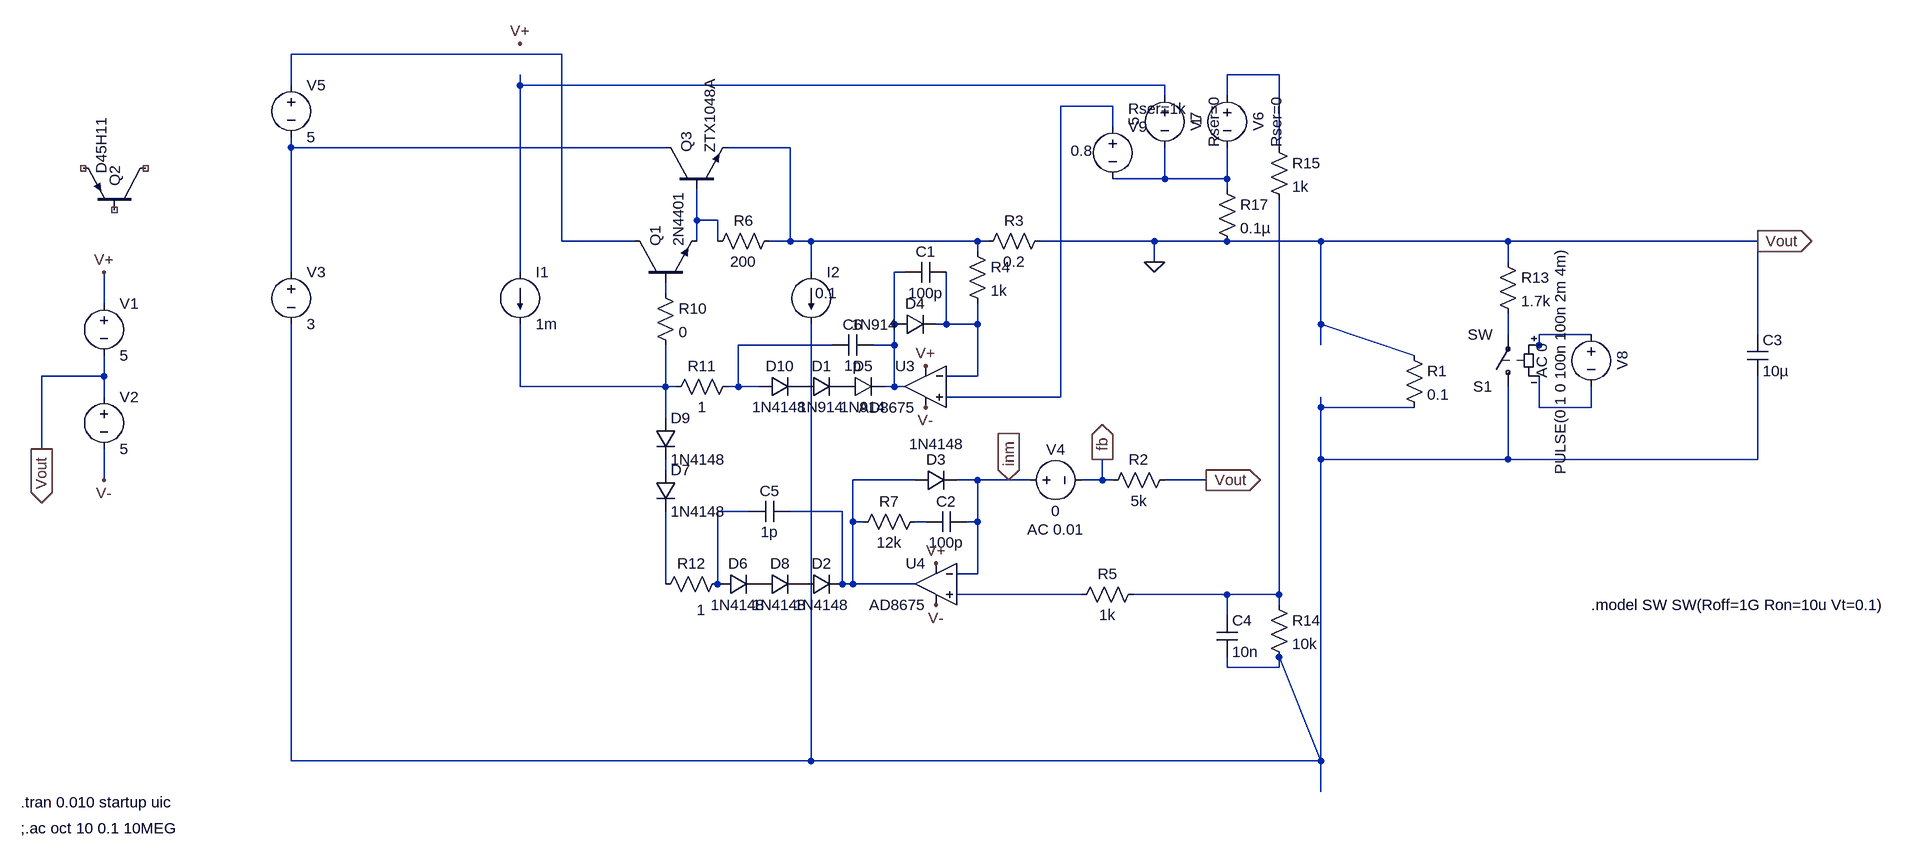
[diagram p0: schematic blackdog_experiments_head.asc]
blackdog_experiments_head.asc, the LTspice schematic file:
Version 4
SHEET 1 2384 1220
WIRE 96 -416 -320 -416
WIRE 1200 -384 1120 -384
WIRE -320 -368 -320 -416
WIRE 32 -368 32 -384
WIRE 1024 -368 32 -368
WIRE 1024 -352 1024 -368
WIRE 1120 -352 1120 -384
WIRE 944 -336 864 -336
WIRE 944 -304 944 -336
WIRE -320 -272 -320 -288
WIRE 256 -272 -320 -272
WIRE 448 -272 352 -272
WIRE 1200 -272 1200 -384
WIRE 1024 -224 1024 -272
WIRE 1024 -224 944 -224
WIRE 1120 -224 1120 -272
WIRE 1120 -224 1024 -224
WIRE 1120 -208 1120 -224
WIRE 304 -160 304 -208
WIRE 336 -160 304 -160
WIRE 96 -128 96 -416
WIRE 208 -128 96 -128
WIRE 304 -128 304 -160
WIRE 336 -128 336 -160
WIRE 448 -128 448 -272
WIRE 448 -128 416 -128
WIRE 480 -128 448 -128
WIRE 736 -128 480 -128
WIRE 752 -128 736 -128
WIRE 1008 -128 832 -128
WIRE 1120 -128 1008 -128
WIRE 1264 -128 1120 -128
WIRE 1552 -128 1264 -128
WIRE 1936 -128 1552 -128
WIRE 736 -112 736 -128
WIRE 1008 -96 1008 -128
WIRE 1552 -96 1552 -128
WIRE -320 -80 -320 -272
WIRE 32 -80 32 -368
WIRE 480 -80 480 -128
WIRE 624 -80 608 -80
WIRE 256 -48 256 -64
WIRE -608 -32 -608 -80
WIRE 608 0 608 -80
WIRE 688 0 688 -80
WIRE 688 0 672 0
WIRE 736 0 736 -32
WIRE 736 0 688 0
WIRE 1264 0 1264 -128
WIRE 1552 16 1552 -16
WIRE 1680 16 1600 16
WIRE 1936 16 1936 -128
WIRE 512 32 368 32
WIRE 608 32 608 0
WIRE 608 32 576 32
WIRE 1264 32 1264 0
WIRE 1600 32 1600 16
WIRE 1600 32 1584 32
WIRE 1408 48 1264 0
WIRE -608 80 -608 48
WIRE -608 80 -704 80
WIRE 736 80 736 0
WIRE 736 80 688 80
WIRE 32 96 32 0
WIRE 256 96 256 32
WIRE 256 96 32 96
WIRE 272 96 256 96
WIRE 368 96 368 32
WIRE 368 96 352 96
WIRE 400 96 368 96
WIRE 608 96 608 32
WIRE 608 96 592 96
WIRE 624 96 608 96
WIRE -608 112 -608 80
WIRE 864 112 864 -336
WIRE 864 112 688 112
WIRE 1264 128 1264 112
WIRE 1408 128 1264 128
WIRE 1600 128 1600 80
WIRE 1680 128 1680 96
WIRE 1680 128 1600 128
WIRE 256 144 256 96
WIRE -704 192 -704 80
WIRE 1264 208 1264 128
WIRE 1552 208 1552 96
WIRE 1552 208 1264 208
WIRE 1936 208 1936 80
WIRE 1936 208 1552 208
WIRE 256 224 256 208
WIRE -608 240 -608 192
WIRE 640 240 544 240
WIRE 736 240 704 240
WIRE 784 240 736 240
WIRE 816 240 784 240
WIRE 928 240 928 208
WIRE 928 240 896 240
WIRE 944 240 928 240
WIRE 1088 240 1024 240
WIRE 384 288 336 288
WIRE 528 288 448 288
WIRE 544 304 544 240
WIRE 560 304 544 304
WIRE 656 304 640 304
WIRE 736 304 736 240
WIRE 736 304 720 304
WIRE 736 384 736 304
WIRE 736 384 704 384
WIRE 256 400 256 288
WIRE 336 400 336 288
WIRE 528 400 528 288
WIRE 544 400 544 304
WIRE 544 400 528 400
WIRE 640 400 544 400
WIRE 896 416 704 416
WIRE 1120 416 976 416
WIRE 1200 416 1200 -192
WIRE 1200 416 1120 416
WIRE 1200 432 1200 416
WIRE 1120 448 1120 416
WIRE 1120 528 1120 512
WIRE 1200 528 1200 512
WIRE 1200 528 1120 528
WIRE -320 672 -320 0
WIRE 480 672 480 0
WIRE 480 672 -320 672
WIRE 1264 672 1264 208
WIRE 1264 672 1200 512
WIRE 1264 672 480 672
WIRE 1264 720 1264 672
FLAG -608 -80 V+
FLAG -608 240 V-
FLAG 32 -432 V+
FLAG 656 64 V+
FLAG 672 368 V+
FLAG 672 432 V-
FLAG 656 128 V-
FLAG 928 208 fb
IOPIN 928 208 Out
FLAG 784 240 inm
IOPIN 784 240 In
FLAG 1936 -128 Vout
IOPIN 1936 -128 Out
FLAG -704 192 Vout
IOPIN -704 192 Out
FLAG 1088 240 Vout
IOPIN 1088 240 Out
FLAG 1008 -96 0
SYMBOL voltage -608 -48 R0
WINDOW 123 0 0 Left 0
WINDOW 39 0 0 Left 0
SYMATTR InstName V1
SYMATTR Value 5
SYMBOL voltage -608 96 R0
WINDOW 123 0 0 Left 0
WINDOW 39 0 0 Left 0
SYMATTR InstName V2
SYMATTR Value 5
SYMBOL npn 208 -64 R270
SYMATTR InstName Q1
SYMATTR Value 2N4401
SYMBOL voltage -320 -96 R0
WINDOW 123 0 0 Left 0
WINDOW 39 0 0 Left 0
SYMATTR InstName V3
SYMATTR Value 3
SYMBOL current 32 -80 R0
WINDOW 123 0 0 Left 0
WINDOW 39 0 0 Left 0
SYMATTR InstName I1
SYMATTR Value 1m
SYMBOL diode 464 112 R270
WINDOW 0 32 32 VTop 2
WINDOW 3 0 32 VBottom 2
SYMATTR InstName D1
SYMATTR Value 1N914
SYMBOL diode 464 416 R270
WINDOW 0 32 32 VTop 2
WINDOW 3 0 32 VBottom 2
SYMATTR InstName D2
SYMATTR Value 1N4148
SYMBOL res 1392 32 R0
SYMATTR InstName R1
SYMATTR Value 0.1
SYMBOL diode 640 256 R270
WINDOW 0 32 32 VTop 2
WINDOW 3 87 33 VBottom 2
SYMATTR InstName D3
SYMATTR Value 1N4148
SYMBOL res 1040 224 R90
WINDOW 0 0 56 VBottom 2
WINDOW 3 32 56 VTop 2
SYMATTR InstName R2
SYMATTR Value 5k
SYMBOL res 736 -112 R270
WINDOW 0 32 56 VTop 2
WINDOW 3 0 56 VBottom 2
SYMATTR InstName R3
SYMATTR Value 0.2
SYMBOL res 720 -128 R0
SYMATTR InstName R4
SYMATTR Value 1k
SYMBOL diode 608 16 R270
WINDOW 0 32 32 VTop 2
WINDOW 3 31 -30 VBottom 2
SYMATTR InstName D4
SYMATTR Value 1N914
SYMBOL cap 688 -96 R90
WINDOW 0 0 32 VBottom 2
WINDOW 3 32 32 VTop 2
SYMATTR InstName C1
SYMATTR Value 100p
SYMBOL pnp -544 -176 M270
WINDOW 0 36 47 Left 2
SYMATTR InstName Q2
SYMATTR Value D45H11
SYMBOL res 240 -64 R0
SYMATTR InstName R10
SYMATTR Value 0
SYMBOL res 368 80 R90
WINDOW 0 0 56 VBottom 2
WINDOW 3 32 56 VTop 2
SYMATTR InstName R11
SYMATTR Value 1
SYMBOL res 352 384 R90
WINDOW 0 0 56 VBottom 2
WINDOW 3 40 41 VTop 2
SYMATTR InstName R12
SYMATTR Value 1
SYMBOL cap 1920 16 R0
SYMATTR InstName C3
SYMATTR Value 10µ
SYMATTR SpiceLine Rser=0.1
SYMBOL Opamps\\AD8675 656 32 M0
SYMATTR InstName U3
SYMBOL Opamps\\AD8675 672 336 M0
SYMATTR InstName U4
SYMBOL res 656 288 R90
WINDOW 0 0 56 VBottom 2
WINDOW 3 32 56 VTop 2
SYMATTR InstName R7
SYMATTR Value 12k
SYMBOL cap 720 288 R90
WINDOW 0 0 32 VBottom 2
WINDOW 3 32 32 VTop 2
SYMATTR InstName C2
SYMATTR Value 100p
SYMBOL voltage 800 240 R270
WINDOW 0 32 56 VTop 2
WINDOW 3 -32 56 VBottom 2
WINDOW 123 -60 56 VBottom 2
WINDOW 39 0 0 Left 0
SYMATTR InstName V4
SYMATTR Value 0
SYMATTR Value2 AC 0.01
SYMBOL voltage 1120 -368 R0
WINDOW 0 32 56 VTop 2
WINDOW 3 -32 56 VBottom 2
WINDOW 123 -60 56 VBottom 2
WINDOW 39 60 56 VTop 2
SYMATTR InstName V6
SYMATTR Value 1
SYMATTR SpiceLine Rser=0
SYMBOL current 480 -80 R0
WINDOW 3 6 32 Left 2
WINDOW 123 0 0 Left 0
WINDOW 39 0 0 Left 0
SYMATTR Value 0.1
SYMATTR InstName I2
SYMBOL sw 1552 112 R180
SYMATTR InstName S1
SYMBOL voltage 1680 0 R0
WINDOW 0 32 56 VTop 2
WINDOW 3 -32 56 VBottom 2
WINDOW 123 -60 56 VBottom 2
WINDOW 39 0 0 Left 0
SYMATTR InstName V8
SYMATTR Value PULSE(0 1 0 100n 100n 2m 4m)
SYMATTR Value2 AC 0
SYMBOL res 1536 -112 R0
SYMATTR InstName R13
SYMATTR Value 1.7k
SYMBOL res 1184 -288 R0
SYMATTR InstName R15
SYMATTR Value 1k
SYMBOL res 1184 416 R0
SYMATTR InstName R14
SYMATTR Value 10k
SYMBOL diode 336 416 R270
WINDOW 0 32 32 VTop 2
WINDOW 3 0 32 VBottom 2
SYMATTR InstName D6
SYMATTR Value 1N4148
SYMBOL voltage 1024 -368 R0
WINDOW 0 32 56 VTop 2
WINDOW 3 -32 56 VBottom 2
WINDOW 123 -60 56 VBottom 2
WINDOW 39 60 56 VTop 2
SYMATTR InstName V7
SYMATTR Value 5
SYMATTR SpiceLine Rser=0
SYMBOL res 1104 -224 R0
SYMATTR InstName R17
SYMATTR Value 0.1µ
SYMBOL voltage 944 -320 R0
WINDOW 123 0 0 Left 0
WINDOW 39 24 -12 Left 2
WINDOW 3 -65 53 Left 2
SYMATTR SpiceLine Rser=1k
SYMATTR Value 0.8
SYMATTR InstName V9
SYMBOL diode 400 416 R270
WINDOW 0 32 32 VTop 2
WINDOW 3 0 32 VBottom 2
SYMATTR InstName D8
SYMATTR Value 1N4148
SYMBOL diode 528 112 R270
WINDOW 0 32 32 VTop 2
WINDOW 3 0 32 VBottom 2
SYMATTR InstName D5
SYMATTR Value 1N914
SYMBOL cap 1104 448 R0
SYMATTR InstName C4
SYMATTR Value 10n
SYMBOL npn 256 -208 R270
SYMATTR InstName Q3
SYMATTR Value ZTX1048A
SYMBOL res 432 -144 R90
WINDOW 0 0 56 VBottom 2
WINDOW 3 32 56 VTop 2
SYMATTR InstName R6
SYMATTR Value 200
SYMBOL diode 240 224 R0
SYMATTR InstName D7
SYMATTR Value 1N4148
SYMBOL diode 240 144 R0
SYMATTR InstName D9
SYMATTR Value 1N4148
SYMBOL voltage -320 -384 R0
WINDOW 123 0 0 Left 0
WINDOW 39 0 0 Left 0
SYMATTR InstName V5
SYMATTR Value 5
SYMBOL cap 448 272 R90
WINDOW 0 0 32 VBottom 2
WINDOW 3 32 32 VTop 2
SYMATTR InstName C5
SYMATTR Value 1p
SYMBOL cap 576 16 R90
WINDOW 0 0 32 VBottom 2
WINDOW 3 32 32 VTop 2
SYMATTR InstName C6
SYMATTR Value 1p
SYMBOL res 992 400 R90
WINDOW 0 0 56 VBottom 2
WINDOW 3 32 56 VTop 2
SYMATTR InstName R5
SYMATTR Value 1k
SYMBOL diode 400 112 R270
WINDOW 0 32 32 VTop 2
WINDOW 3 0 32 VBottom 2
SYMATTR InstName D10
SYMATTR Value 1N4148
TEXT -736 736 Left 2 !.tran 0.010 startup uic
TEXT -736 776 Left 2 !;.ac oct 10 0.1 10MEG
TEXT 1680 432 Left 2 !.model SW SW(Roff=1G Ron=10u Vt=0.1)

The netlist it stands for:
* blackdog_experiments_head.asc
V1 V+ 0 5
V2 0 V- 5
Q1 N001 N010 N008 0 2N4401
V3 N005 N016 3
I1 N003 N015 1m
D1 P001 P002 1N914
D2 P003 N019 1N4148
R1 0 N016 0.1
D3 N019 inm 1N4148
R2 0 fb 5k
R3 N006 0 0.2
R4 N006 N011 1k
D4 N009 N011 1N914
C1 N011 N009 100p
Q2 NC_01 NC_02 NC_03 0 D45H11
R10 N010 N015 0
R11 N014 N015 1
R12 N020 N022 1
C3 0 N016 10µ Rser=0.1
XU3 N004 N011 V+ V- N009 AD8675  ; pins In+ In- V+ V- OUT
XU4 N023 inm V+ V- N019 AD8675  ; pins In+ In- V+ V- OUT
R7 N021 N019 12k
C2 inm N021 100p
V4 inm fb 0 AC 0.01
V6 N002 N007 1 Rser=0
I2 N006 N016 0.1
S1 N016 N012 N013 N017 SW
V8 N013 N017 PULSE(0 1 0 100n 100n 2m 4m) AC 0
R13 0 N012 1.7k
R15 N002 N024 1k
R14 N024 N016 10k
D6 N020 P004 1N4148
V7 N003 N007 5 Rser=0
R17 N007 0 0.1µ
V9 N004 N007 0.8 Rser=1k
D8 P004 P003 1N4148
D5 P002 N009 1N914
C4 N024 N016 10n
Q3 N005 N008 N006 0 ZTX1048A
R6 N006 N008 200
D7 N018 N022 1N4148
D9 N015 N018 1N4148
V5 N001 N005 5
C5 N019 N020 1p
C6 N009 N014 1p
R5 N024 N023 1k
D10 N014 P001 1N4148
.model D D
.lib standard.dio
.model NPN NPN
.model PNP PNP
.lib standard.bjt
.tran 0.010 startup uic
;.ac oct 10 0.1 10MEG
.model SW SW(Roff=1G Ron=10u Vt=0.1)
.backanno
.end